# Altium schematic sheet RFID_transmitter_V2.SchDoc
size A
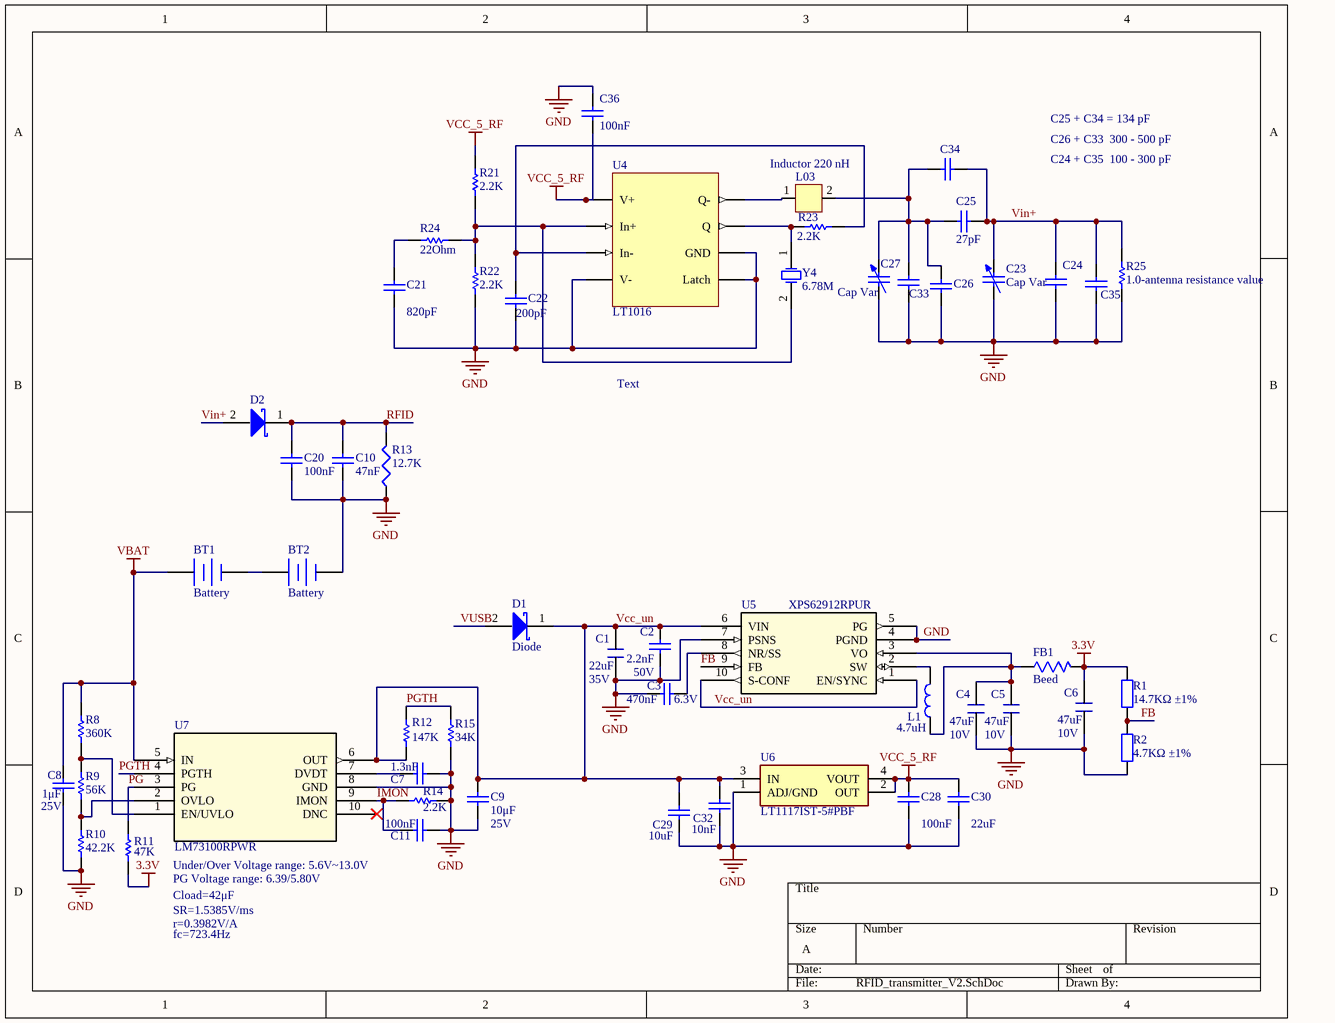
[diagram p0: RFID_transmitter_V2.SchDoc]

## Parts
BT1  Battery  [Battery]
BT2  Battery  [Battery]
C1  value 22uF  Voltage: 35V  [C0805]  (hidden comment: Multilayer Ceramic Capacitor)
C2  value 2.2nF  Voltage: 50V  [0402]  (hidden comment: Cap Semi)
C3  value 470nF  Voltage: 6.3V  [1608[0603]]  (hidden comment: Cap Semi)
C4  value 47uF  Voltage: 10V  [C0805]  (hidden comment: Multilayer Ceramic Capacitor)
C5  value 47uF  Voltage: 10V  [C0805]  (hidden comment: Multilayer Ceramic Capacitor)
C6  value 47uF  Voltage: 10V  [C0805]  (hidden comment: Multilayer Ceramic Capacitor)
C7  value 1.3nF  [0402]  (hidden comment: Cap Semi)
C8  value 1μF  Voltage: 25V  [1608[0603]]  (hidden comment: Cap Semi)
C9  value 10μF  Voltage: 25V  [1608[0603]]  (hidden comment: Cap Semi)
C10  value 47nF  [1608[0603]]  (hidden comment: Cap 100n)
C11  value 100nF  [0402]  (hidden comment: Cap Semi)
C20  value 100nF  [1608[0603]]  (hidden comment: Cap 100n)
C21  value 820pF  [0603]  (hidden comment: Cap 820p)
C22  value 200pF  [0603]  (hidden comment: Cap 200p)
C23  Cap Var  [Variable_Capacitor_JZ400HV1]
C24  Cap  [0603]  (value not drawn)
C25  value 27pF  [0603]  (hidden comment: Cap)
C26  random value needs carefully address  [0603]  (value not drawn)
C27  Cap Var  [Variable_Capacitor_JZ400HV1]
C28  value 100nF  [0603]  (hidden comment: Cap 100n)
C29  value 10uF  [0603]  (hidden comment: Cap 10u)
C30  value 22uF  [0603]  (hidden comment: Cap 22u)
C32  value 10nF  [0603]  (hidden comment: Cap 10n)
C33  random value needs carefully address  [0603]  (value not drawn)
C34  Cap  [0603]  (value not drawn)
C35  Cap  [0603]  (value not drawn)
C36  value 100nF  [C1210]  (hidden comment: C3225C0G1H104JT000N)
D1  Diode  [SODFL3616X98N]
D2  Diode  [SOD3716X135N]  (value not drawn)
FB1  Beed  [BEADC2012X110N]
L1  value 4.7uH  [XGL4030]  (hidden comment: XGL4030)
L03  Inductor 220 nH  [Ferrite_bead_0805inch_2012mm]
R1  14.7KΩ ±1%  [LC-0402_R]
R2  4.7KΩ ±1%  [LC-0402_R]
R8  value 360K  [0402-A]  (hidden comment: Res 2.2KΩ ±1%)
R9  value 56K  [0402-A]  (hidden comment: Res 2.2KΩ ±1%)
R10  value 42.2K  [0402-A]  (hidden comment: Res 2.2KΩ ±1%)
R11  value 47K  [0402-A]  (hidden comment: Res 2.2KΩ ±1%)
R12  value 147K  [0402-A]  (hidden comment: Res 2.2KΩ ±1%)
R13  value 12.7K  [J1-0603]  (hidden comment: Res 12.7KΩ ±1%)
R14  value 2.2K  [0402-A]  (hidden comment: Res 2.2KΩ ±1%)
R15  value 34K  [0402-A]  (hidden comment: Res 2.2KΩ ±1%)
R21  value 2.2K  [J1-0603]  (hidden comment: Res 2.2KΩ ±1%)
R22  value 2.2K  [J1-0603]  (hidden comment: Res 2.2KΩ ±1%)
R23  value 2.2K  [J1-0603]  (hidden comment: Res 2.2KΩ ±1%)
R24  value 22Ohm  [J1-0603]  (hidden comment: Res 2.2KΩ ±1%)
R25  value 1.0-antenna resistance value  [J1-0603]  (hidden comment: Res 2.2KΩ ±1%)
U4  LT1016  [LT1016_SOIC]
U5  XPS62912RPUR  [VQFN-HR10_RPU_TEX]
U6  LT1117IST-5#PBF  [SOT230P700X180-4N]
U7  LM73100RPWR  [VQFN-HR-10_2X2_TEX]
Y4  Frequency: 6.78M  [HC-49SMD]  (hidden comment: CRYSTAL)

## Nets
3.3V: C6.2 FB1.2 R1.2 R11.1
GND: BT2.2(-) C1.1 C2.1 C3.1 C4.1 C5.1 C6.1 C7.1 C8.1 C9.1 C10.2 C11.1 C20.2 C21.1 C22.1 C23.1 C24.1 C26.2 C27.1 C28.1 C29.1 C30.1 C32.1 C33.2 C35.1 C36.2 R2.1 R10.1 R13.1 R14.1 R15.1 R22.1 R25.2 U4.4(V-) U4.5(Latch) U4.6(GND) U5.4(PGND) U5.5(PG) U5.7(PSNS) U6.1(ADJ/GND) U7.8(GND)
VBAT: BT1.1(+) C8.2 R8.2 U7.5(IN)
VCC_5_RF: C28.2 C30.2 C36.1 R21.2 U4.1(V+) U6.2(OUT) U6.4(VOUT)
FB: R1.1 R2.2 U5.9(FB)
IMON: C11.2 R14.2 U7.9(IMON)
PG: R11.2 U7.3(PG)
PGTH: R12.2 R15.2 U7.4(PGTH)
RFID: C10.1 C20.1 D2.1(ANODE) R13.2
Vcc_un: C1.2 C2.2 C9.2 C29.2 C32.2 D1.1(ANODE) R12.1 U5.1(EN/SYNC) U5.6(VIN) U5.10(S-CONF) U6.3(IN) U7.6(OUT)
Vin+: C23.2 C24.2 C25.1 C34.1 C35.2 D2.2(CATHODE) R25.1
VUSB: D1.2(CATHODE)
NetBT1_2: BT1.2(-) BT2.1(+)
NetC3_2: C3.2 U5.8(NR/SS)
NetC4_2: C4.2 C5.2 FB1.1 L1.1 U5.3(VO)
NetC7_2: C7.2 U7.7(DVDT)
NetC21_2: C21.2 R24.2
NetC22_2: C22.2 R23.1 U4.3(In-)
NetC25_2: C25.2 C26.1 C27.2 C33.1 C34.2 L03.2
NetL1_2: L1.2 U5.2(SW)
NetL03_1: L03.1 U4.8(Q-)
NetR8_1: R8.1 R9.2 U7.1(EN/UVLO)
NetR9_1: R9.1 R10.2 U7.2(OVLO)
NetR21_1: R21.1 R22.2 R24.1 U4.2(In+) Y4.2(OSC2)
NetR23_2: R23.2 U4.7(Q) Y4.1(OSC1)

Not connected (* = marked no-connect by the designer): U7 10(DNC)*

## Notes on the sheet
- C25 + C34 = 134 pF
- C26 + C33  300 - 500 pF
- C24 + C35  100 - 300 pF
- Text
- Cload=42μF
- Under/Over Voltage range: 5.6V~13.0V
- PG Voltage range: 6.39/5.80V
- r=0.3982V/A
- fc=723.4Hz
- SR=1.5385V/ms

## Library data of the parts
BT1 BT2 = Battery: Multicell Battery; Published: 24-Mar-1999; LatestRevisionDate: 17-Jul-2002; LatestRevisionNote: Re-released for DXP Platform.; PackageReference: BAT-2; Publisher: Altium Limited; PackageDescription: Battery; 2 Leads
C1 = C-Ceramic: Part Number: C2012X5R1V226M125AC; Manufacturer: TDK
C2 = Cap Semi: Capacitor (Semiconductor SIM Model); Part Number: GRM155R71H222KA01D; Manufacturer: MuRata; Published: 8-Jun-2000; LatestRevisionDate: 29-May-2009; LatestRevisionNote: IPC-7351 Footprint Added.; PackageReference: C1206; Publisher: Altium Limited; PackageDescription: Chip Capacitor
C3 = Cap Semi: Capacitor (Semiconductor SIM Model); Manufacturer: MuRata; Part Number: GRM188R60J474KA01D; Published: 8-Jun-2000; LatestRevisionDate: 29-May-2009; LatestRevisionNote: IPC-7351 Footprint Added.; PackageReference: C1206; Publisher: Altium Limited; PackageDescription: Chip Capacitor
C4-C6 = C-Ceramic: Part Number: C2012X5R1A476M125AC; Manufacturer: TDK
C7 = Cap Semi: 多层陶瓷电容器MLCC - SMD/SMT 1.3nF 50VDC X7R 5% 0402; Part Number: GRM155R71H132JA01D; Manufacturer: MuRata; Voltage: 50V; Published: 8-Jun-2000; LatestRevisionDate: 29-May-2009; LatestRevisionNote: IPC-7351 Footprint Added.; PackageReference: C1206; Publisher: Altium Limited; PackageDescription: Chip Capacitor
C8 = Cap Semi: 多层陶瓷电容器MLCC - SMD/SMT 0603 1uF 25V X6S 10%; Manufacturer: MuRata; Part Number: GRM188C81E105KAADD; Published: 8-Jun-2000; LatestRevisionDate: 29-May-2009; LatestRevisionNote: IPC-7351 Footprint Added.; PackageReference: C1206; Publisher: Altium Limited; PackageDescription: Chip Capacitor
C9 = Cap Semi: Capacitor (Semiconductor SIM Model); Manufacturer: MuRata; Part Number: GRM188R61E106KA73D; Published: 8-Jun-2000; LatestRevisionDate: 29-May-2009; LatestRevisionNote: IPC-7351 Footprint Added.; PackageReference: C1206; Publisher: Altium Limited; PackageDescription: Chip Capacitor
C10 = Cap Semi: Capacitor; Part Number: CL10B473KB8NNNC; Manufacturer: SAMSUNG; Voltage: 50V; Published: 8-Jun-2000; LatestRevisionDate: 29-May-2009; LatestRevisionNote: IPC-7351 Footprint Added.; PackageReference: C1206; Publisher: Altium Limited; PackageDescription: Chip Capacitor
C11 = Cap Semi: 多层陶瓷电容器MLCC - SMD/SMT 100nF 10VDC X5R 5% 0402; Part Number: GRM155R61A104JA01D; Manufacturer: MuRata; Voltage: 10V; Published: 8-Jun-2000; LatestRevisionDate: 29-May-2009; LatestRevisionNote: IPC-7351 Footprint Added.; PackageReference: C1206; Publisher: Altium Limited; PackageDescription: Chip Capacitor
C20 = Cap Semi: Capacitor; Part Number: CL10B104KB8NNNC; Manufacturer: SAMSUNG; Voltage: 50V; Published: 8-Jun-2000; LatestRevisionDate: 29-May-2009; LatestRevisionNote: IPC-7351 Footprint Added.; PackageReference: C1206; Publisher: Altium Limited; PackageDescription: Chip Capacitor
C21 C22 C28 C30 C32 = Cap: Capacitor; Published: 8-Jun-2000; LatestRevisionDate: 17-Jul-2002; LatestRevisionNote: Re-released for DXP Platform.; PackageReference: RAD-0.3; Publisher: Altium Limited; PackageDescription: Radial Cap, Thru-Hole; 2 Leads; 0.3 in Pin Spacing
C23 C27 = Cap Var: Variable or Adjustable Capacitor; Value: 100pF; Published: 24-Mar-1999; LatestRevisionDate: 29-May-2009; LatestRevisionNote: IPC-7351 Footprint Added.; PackageReference: C1210; Publisher: Altium Limited; PackageDescription: Chip Capacitor 1210 Case Size; Code_JEITA: 1210; Code_IPC: CAPC3225
C24 = Cap: Capacitor_for resonance; Value: 22pF; Published: 8-Jun-2000; LatestRevisionDate: 17-Jul-2002; LatestRevisionNote: Re-released for DXP Platform.; PackageReference: RAD-0.3; Publisher: Altium Limited; PackageDescription: Radial Cap, Thru-Hole; 2 Leads; 0.3 in Pin Spacing
C25 = Cap: Capacitor_for resonance; Published: 8-Jun-2000; LatestRevisionDate: 17-Jul-2002; LatestRevisionNote: Re-released for DXP Platform.; PackageReference: RAD-0.3; Publisher: Altium Limited; PackageDescription: Radial Cap, Thru-Hole; 2 Leads; 0.3 in Pin Spacing
C26 = Cap: Capacitor_for resonance; Value: 470pF; Published: 8-Jun-2000; LatestRevisionDate: 17-Jul-2002; LatestRevisionNote: Re-released for DXP Platform.; PackageReference: RAD-0.3; Publisher: Altium Limited; PackageDescription: Radial Cap, Thru-Hole; 2 Leads; 0.3 in Pin Spacing
C29 = Cap: Capacitor; Part Number: GRM188R61E106KA73D; Manufacturer: Murata; Published: 8-Jun-2000; LatestRevisionDate: 17-Jul-2002; LatestRevisionNote: Re-released for DXP Platform.; PackageReference: RAD-0.3; Publisher: Altium Limited; PackageDescription: Radial Cap, Thru-Hole; 2 Leads; 0.3 in Pin Spacing
C33-C35 = Cap: Capacitor_for resonance; Value: 1pF; Published: 8-Jun-2000; LatestRevisionDate: 17-Jul-2002; LatestRevisionNote: Re-released for DXP Platform.; PackageReference: RAD-0.3; Publisher: Altium Limited; PackageDescription: Radial Cap, Thru-Hole; 2 Leads; 0.3 in Pin Spacing
C36 = Cap Semi: Capacitor (Semiconductor SIM Model); Manufacturer: TDK; Voltage: 10V; Published: 8-Jun-2000; LatestRevisionDate: 29-May-2009; LatestRevisionNote: IPC-7351 Footprint Added.; PackageReference: C1206; Publisher: Altium Limited; PackageDescription: Chip Capacitor; Part Number: C3225C0G1H104JT000N
D1 = MBR120VLSFT1G: Schottky Power Rectifier, Surface Mount; Manufacturer_Name: ON Semiconductor; Datasheet Link: http://www.onsemi.com/pub/Collateral/MBR120VLSFT1-D.PDF; Height: 0.98mm; Manufacturer_Part_Number: MBR120VLSFT1G; Arrow Part Number: MBR120VLSFT1G; Arrow Price/Stock: https://www.arrow.com/en/products/mbr120vlsft1g/on-semiconductor; Mouser Part Number: 863-MBR120VLSFT1G; Mouser Price/Stock: https://www.mouser.co.uk/ProductDetail/ON-Semiconductor/MBR120VLSFT1G?qs=3JMERSakebpX%252BkItPpFCkg%3D%3D
D2 = MBR0540T1G: Surface Mount Schottky Power Rectifier; Manufacturer_Name: ON Semiconductor; Datasheet Link: http://www.onsemi.com/pub/Collateral/MBR0540T1-D.PDF; Height: 1.35mm; Manufacturer_Part_Number: MBR0540T1G; Arrow Part Number: MBR0540T1G; Arrow Price/Stock: https://www.arrow.com/en/products/mbr0540t1g/on-semiconductor; Mouser Part Number: 863-MBR0540T1G; Mouser Price/Stock: https://www.mouser.co.uk/ProductDetail/ON-Semiconductor/MBR0540T1G?qs=3JMERSakebqeY0cO5%252BUPCQ%3D%3D
FB1 = 782853200: Wurth Ferrite Bead; Manufacturer_Name: Wurth Elektronik; Datasheet Link: http://katalog.we-online.de/pbs/datasheet/782853200.pdf; Height: 1.1mm; Manufacturer_Part_Number: 782853200
L1 = Inductor: Coilcraft Shielded Power Inductors; Part Number: XGL4030-472MEC; Manufacturer: Coilcraft
L03 = Component_1: 220nH
R1 = 0402 1KΩ (1001) 1%: 贴片电阻; Part Number: CRCW040214K7FKED; Manufacturer: Vishay-Dale; ComponentLink1Description: 供应商链接; ComponentLink1URL: http://www.szlcsc.com/product/details_12256.html; Package: 0402
R2 = 0402 1KΩ (1001) 1%: 贴片电阻; Part Number: CRCW04024K70FKED; Manufacturers: Vishay-Dale; ComponentLink1Description: 供应商链接; ComponentLink1URL: http://www.szlcsc.com/product/details_12256.html; Package: 0402
R8 = Res1: Resistor; Part Number: RC0402FR-07360KL; Manufacturer: YAGEO; Published: 8-Jun-2000; LatestRevisionDate: 17-Jul-2002; LatestRevisionNote: Re-released for DXP Platform.; PackageReference: AXIAL-0.3; Publisher: Altium Limited; PackageDescription: Axial Device, Thru-Hole; 2 Leads; 0.3 in Pin Spacing
R9 = Res1: Resistor; Part Number: RC0402FR-0756KL; Manufacturer: YAGEO; Published: 8-Jun-2000; LatestRevisionDate: 17-Jul-2002; LatestRevisionNote: Re-released for DXP Platform.; PackageReference: AXIAL-0.3; Publisher: Altium Limited; PackageDescription: Axial Device, Thru-Hole; 2 Leads; 0.3 in Pin Spacing
R10 R21-R23 = Res1: Resistor; Part Number: RC0603FR-072K2L; Manufacturer: YAGEO; Published: 8-Jun-2000; LatestRevisionDate: 17-Jul-2002; LatestRevisionNote: Re-released for DXP Platform.; PackageReference: AXIAL-0.3; Publisher: Altium Limited; PackageDescription: Axial Device, Thru-Hole; 2 Leads; 0.3 in Pin Spacing
R11 = Res1: Resistor; Part Number: RC0402FR-0747KL; Manufacturer: YAGEO; Published: 8-Jun-2000; LatestRevisionDate: 17-Jul-2002; LatestRevisionNote: Re-released for DXP Platform.; PackageReference: AXIAL-0.3; Publisher: Altium Limited; PackageDescription: Axial Device, Thru-Hole; 2 Leads; 0.3 in Pin Spacing
R12 = Res1: Resistor; Part Number: RC0402FR-07147KL; Manufacturer: YAGEO; Published: 8-Jun-2000; LatestRevisionDate: 17-Jul-2002; LatestRevisionNote: Re-released for DXP Platform.; PackageReference: AXIAL-0.3; Publisher: Altium Limited; PackageDescription: Axial Device, Thru-Hole; 2 Leads; 0.3 in Pin Spacing
R13 = Res3: Resistor; Part Number: RC0603FR-0712K7L; Manufacturer: YAGEO; Published: 8-Jun-2000; LatestRevisionDate: 29-May-2009; LatestRevisionNote: IPC-7351 Footprint Added.; PackageReference: J1-0603; Publisher: Altium Limited; PackageDescription: Chip Resistor
R14 = Res1: Resistor; Part Number: RC0402FR-072K2L; Manufacturer: YAGEO; Published: 8-Jun-2000; LatestRevisionDate: 17-Jul-2002; LatestRevisionNote: Re-released for DXP Platform.; PackageReference: AXIAL-0.3; Publisher: Altium Limited; PackageDescription: Axial Device, Thru-Hole; 2 Leads; 0.3 in Pin Spacing
R15 = Res1: Resistor; Part Number: RC0402FR-0734KL; Manufacturer: YAGEO; Published: 8-Jun-2000; LatestRevisionDate: 17-Jul-2002; LatestRevisionNote: Re-released for DXP Platform.; PackageReference: AXIAL-0.3; Publisher: Altium Limited; PackageDescription: Axial Device, Thru-Hole; 2 Leads; 0.3 in Pin Spacing
R24 = Res1: Resistor; Part Number: RC0603FR-0722RL; Manufacturer: YAGEO; Published: 8-Jun-2000; LatestRevisionDate: 17-Jul-2002; LatestRevisionNote: Re-released for DXP Platform.; PackageReference: AXIAL-0.3; Publisher: Altium Limited; PackageDescription: Axial Device, Thru-Hole; 2 Leads; 0.3 in Pin Spacing
R25 = Res1: Resistor; Part Number: RC0603FR-071RL; Manufacturer: YAGEO; Published: 8-Jun-2000; LatestRevisionDate: 17-Jul-2002; LatestRevisionNote: Re-released for DXP Platform.; PackageReference: AXIAL-0.3; Publisher: Altium Limited; PackageDescription: Axial Device, Thru-Hole; 2 Leads; 0.3 in Pin Spacing
U5 = XPS62912RPUR: No Description Available; Vendor: Texas Instruments; Built_By: EMA_Cory; SourceLibrary: TI_2020-08-27; Datasheet: https://www.ti.com/lit/ds/symlink/tps62913.pdf?ts=1598546293590&ref_url=https%253A%252F%252Fwww.ti.com%252Fproduct%252FTPS62913; Manufacturer_Part_Number: XPS62912RPUR; Copyright: Copyright (C) 2018 Accelerated Designs. All rights reserved; RefDes: RefDes; Type: DEV
U7 = LM73100RPWR: No Description Available; Vendor: Texas Instruments; Built_By: EMA_Anthony; SourceLibrary: Add_to_database_2020-10-23; Datasheet: https://www.ti.com/lit/ds/symlink/lm7310.pdf?ts=1603393347029&ref_url=https%253A%252F%252Fwww.ti.com%252Fproduct%252FLM7310%253FHQS%253DTI-null-null-octopart-df-pf-null-wwe; Manufacturer_Part_Number: LM73100RPWR; Copyright: Copyright (C) 2018 Accelerated Designs. All rights reserved; RefDes: RefDes; Type: DEV
Y4 = CRYSTAL: Industry standard SMD crystal; Part Number: LFXTAL057410Bulk; Manufacturer: IQD